# Altium schematic sheet Inputs.SchDoc: USB Relay Module: Digital Inputs
size A4; DrawnBy: A.G.; DocumentNumber: 1; Revision: A; SheetNumber: 2; SheetTotal: 3
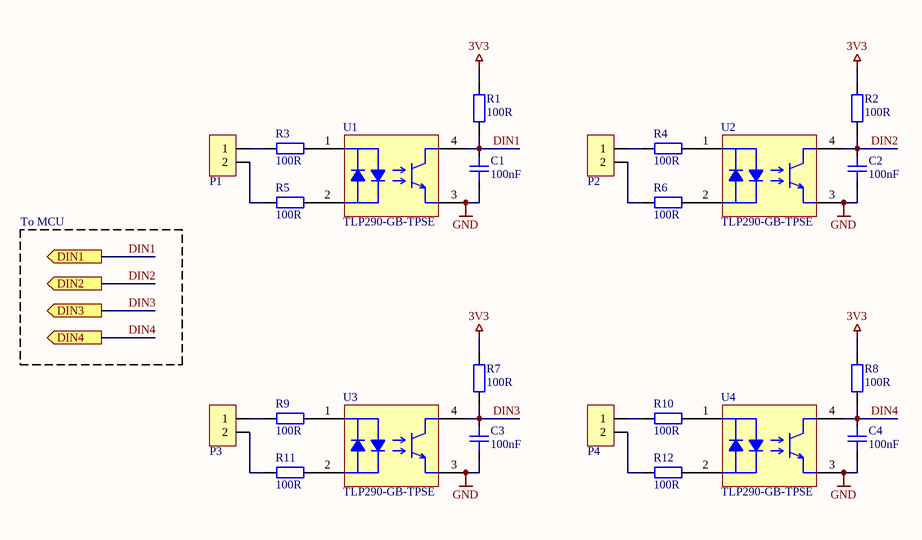
[diagram p0: Inputs.SchDoc]

## Parts
C1  100nF  [C0805]
C2  100nF  [C0805]
C3  100nF  [C0805]
C4  100nF  [C0805]
P1  PINHDR_2x1  [HEADER-2.54-2P1]  (value not drawn)
P2  PINHDR_2x1  [HEADER-2.54-2P1]  (value not drawn)
P3  PINHDR_2x1  [HEADER-2.54-2P1]  (value not drawn)
P4  PINHDR_2x1  [HEADER-2.54-2P1]  (value not drawn)
R1  100R  [R0805]
R2  100R  [R0805]
R3  100R  [R0805]
R4  100R  [R0805]
R5  100R  [R0805]
R6  100R  [R0805]
R7  100R  [R0805]
R8  100R  [R0805]
R9  100R  [R0805]
R10  100R  [R0805]
R11  100R  [R0805]
R12  100R  [R0805]
U1  TLP290-GB-TPSE  [SO-4-SOIC127P600-8N]
U2  TLP290-GB-TPSE  [SO-4-SOIC127P600-8N]
U3  TLP290-GB-TPSE  [SO-4-SOIC127P600-8N]
U4  TLP290-GB-TPSE  [SO-4-SOIC127P600-8N]

## Ports
DIN1 (out), DIN2 (out), DIN3 (out), DIN4 (out)

## Nets
3V3: R1.1 R2.1 R7.1 R8.1
GND: C1.1 C2.1 C3.1 C4.1 U1.3 U2.3 U3.3 U4.3
DIN1: C1.2 R1.2 U1.4 ; port DIN1
DIN2: C2.2 R2.2 U2.4 ; port DIN2
DIN3: C3.2 R7.2 U3.4 ; port DIN3
DIN4: C4.2 R8.2 U4.4 ; port DIN4
NetP1_1: P1.1 R3.2
NetP1_2: P1.2 R5.2
NetP2_1: P2.1 R4.2
NetP2_2: P2.2 R6.2
NetP3_1: P3.1 R9.2
NetP3_2: P3.2 R11.2
NetP4_1: P4.1 R10.2
NetP4_2: P4.2 R12.2
NetR3_1: R3.1 U1.1
NetR4_1: R4.1 U2.1
NetR5_1: R5.1 U1.2
NetR6_1: R6.1 U2.2
NetR9_1: R9.1 U3.1
NetR10_1: R10.1 U4.1
NetR11_1: R11.1 U3.2
NetR12_1: R12.1 U4.2

## Notes on the sheet
- To MCU
- Author
- Date
- Revision
- Size
- A4
- Sheet
- of

## Library data of the parts
C1-C4 = C: Generic Capacitor; Tolerance: 20%; Value: 100nF; MountingTechnology: SMT; BaseProduct: *
P1-P4 = PINHDR_2x1: Generic Pin Header 2x1
R1-R12 = R: Generic Resistor; Tolerance: 1%; Value: 100R; MountingTechnology: SMT; BaseProduct: *
U1-U4 = TLP290-GB-TPSE: OPTOISOLATOR 3.75KV TRANS 4-SO; URL: https://www.digikey.co.uk/product-detail/en/toshiba-semiconductor-and-storage/TLP290-GB-TPSE/TLP290-GB-TPSECT-ND/4562941; MountingTechnology: SMT